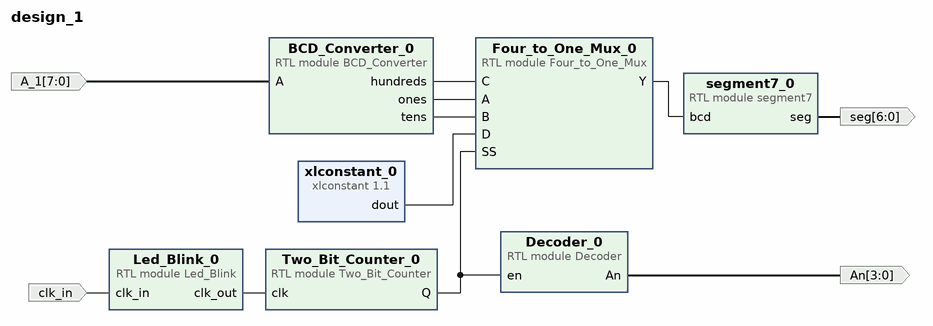
[diagram p0: block diagram of the top level]
# Vivado block design design_1, xc7a35tcpg236-1, Vivado 2021.1
create_bd_design design_1

create_bd_port -dir I clk_in
create_bd_port -dir I -from 7 -to 0 A_1
create_bd_port -dir O -from 6 -to 0 seg
create_bd_port -dir O -from 3 -to 0 An

create_bd_cell -type module -reference Two_Bit_Counter Two_Bit_Counter_0
create_bd_cell -type module -reference segment7 segment7_0
create_bd_cell -type ip -vlnv xilinx.com:ip:xlconstant:1.1 xlconstant_0
set_property -dict {CONFIG.CONST_VAL 0 CONFIG.CONST_WIDTH 4} [get_bd_cells xlconstant_0]
create_bd_cell -type module -reference Decoder Decoder_0
create_bd_cell -type module -reference Four_to_One_Mux Four_to_One_Mux_0
create_bd_cell -type module -reference Led_Blink Led_Blink_0
create_bd_cell -type module -reference BCD_Converter BCD_Converter_0

# ---- connections ----

connect_bd_net -net A_1_1 [get_bd_ports A_1] [get_bd_pins BCD_Converter_0/A]
connect_bd_net [get_bd_pins BCD_Converter_0/hundreds] [get_bd_pins Four_to_One_Mux_0/C]
connect_bd_net [get_bd_pins BCD_Converter_0/ones] [get_bd_pins Four_to_One_Mux_0/A]
connect_bd_net [get_bd_pins BCD_Converter_0/tens] [get_bd_pins Four_to_One_Mux_0/B]
connect_bd_net [get_bd_pins Decoder_0/An] [get_bd_ports An]
connect_bd_net [get_bd_pins Four_to_One_Mux_0/Y] [get_bd_pins segment7_0/bcd]
connect_bd_net [get_bd_pins Led_Blink_0/clk_out] [get_bd_pins Two_Bit_Counter_0/clk]
connect_bd_net [get_bd_pins Two_Bit_Counter_0/Q] [get_bd_pins Decoder_0/en] [get_bd_pins Four_to_One_Mux_0/SS]
connect_bd_net [get_bd_ports clk_in] [get_bd_pins Led_Blink_0/clk_in]
connect_bd_net [get_bd_pins segment7_0/seg] [get_bd_ports seg]
connect_bd_net [get_bd_pins xlconstant_0/dout] [get_bd_pins Four_to_One_Mux_0/D]

validate_bd_design
save_bd_design
